# Altium project BELL.PrjPcb
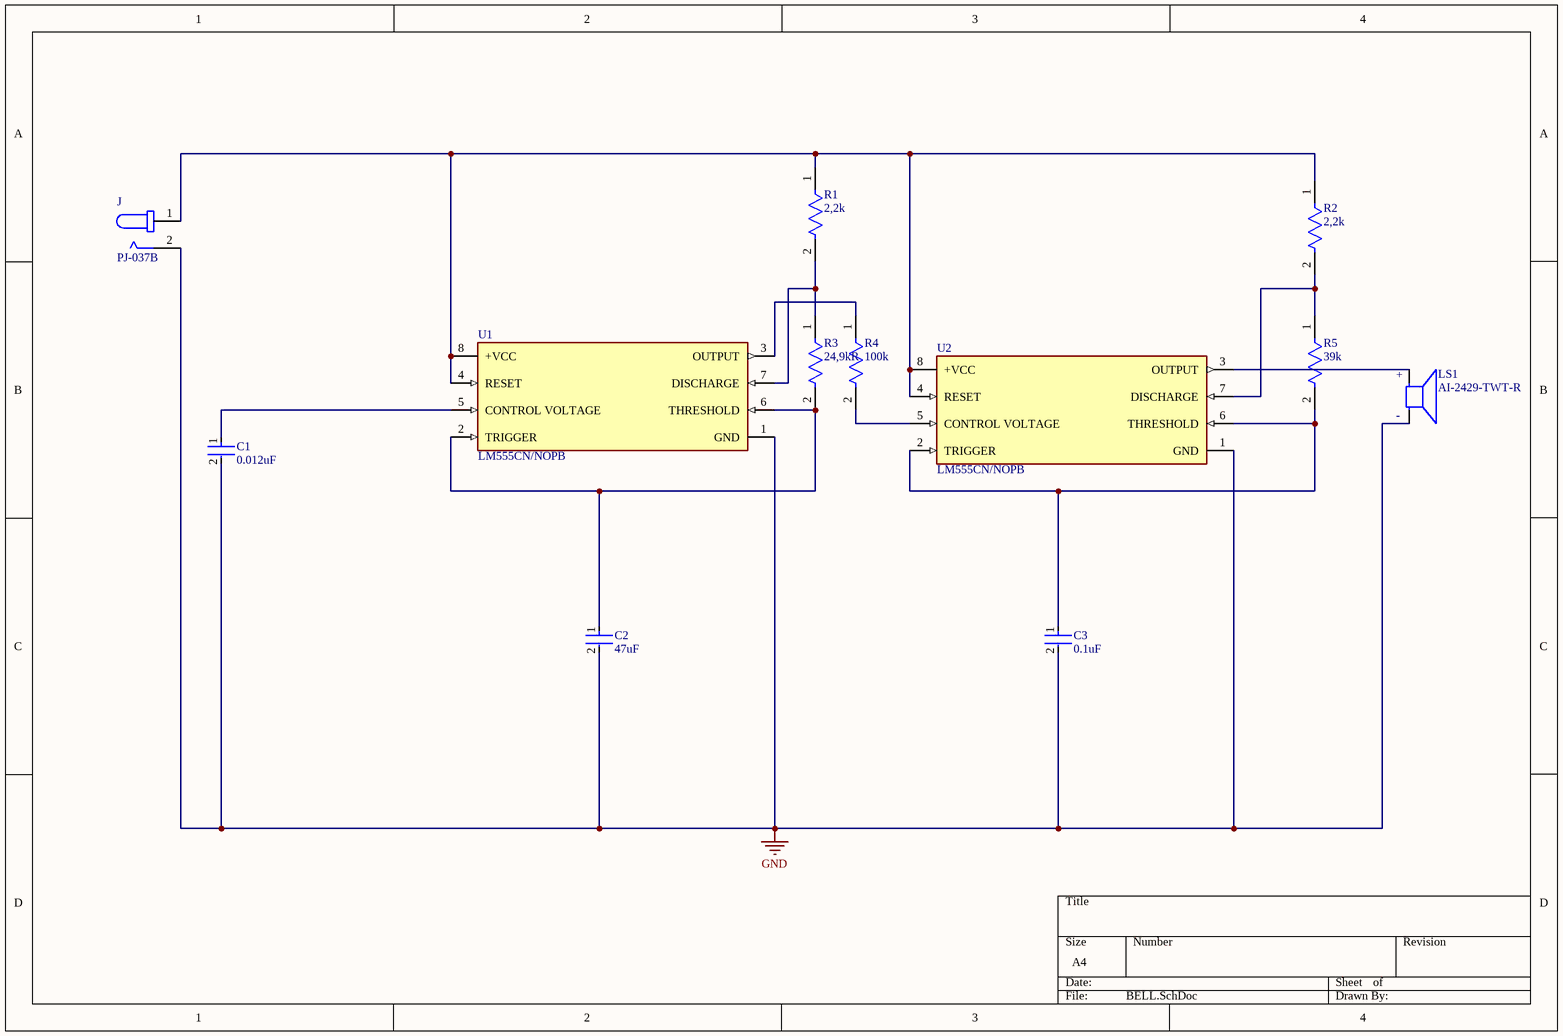
[diagram p0: BELL.SchDoc]
1 sheet, 12 parts. Net scope: global (net labels, ports and power ports of the same name join across sheets).
Board file: BELL.PcbDoc

## Sheet BELL.SchDoc
size A4

### Parts
C1  0.012uF  [FP-GRM033-0_03-IPC_B]
C2  47uF  [FP-MK325M-IPC_B]
C3  0.1uF  [FP-CL46-IPC_B]
J  PJ-037B  [CUI_PJ-037B]
LS1  AI-2429-TWT-R  [XDCR_AI-2429-TWT-R]
R1  2,2k  [FP-RMCF0805-IPC_B]
R2  2,2k  [FP-RMCF0805-IPC_B]
R3  24,9kR  [FP-RT0805-IPC_B]
R4  100k  [FP-CRCW0805-e3-IPC_B]
R5  39k  [FP-KTR10-IPC_B]
U1  LM555CN/NOPB  [FP-P0008A-MFG]
U2  LM555CN/NOPB  [FP-P0008A-MFG]

### Nets
GND: C1.2 C2.2 C3.2 J.2 LS1.N U1.1(GND) U2.1(GND)
NetC1_1: C1.1 U1.5(CONTROL_VOLTAGE)
NetC2_1: C2.1 R3.2 U1.2(TRIGGER) U1.6(THRESHOLD)
NetC3_1: C3.1 R5.2 U2.2(TRIGGER) U2.6(THRESHOLD)
NetJ_1: J.1 R1.1 R2.1 U1.4(RESET) U1.8(+VCC) U2.4(RESET) U2.8(+VCC)
NetLS1_P: LS1.P U2.3(OUTPUT)
NetR1_2: R1.2 R3.1 U1.7(DISCHARGE)
NetR2_2: R2.2 R5.1 U2.7(DISCHARGE)
NetR4_1: R4.1 U1.3(OUTPUT)
NetR4_2: R4.2 U2.5(CONTROL_VOLTAGE)

### Notes on the sheet
- (in symbol AI-2429-TWT-R) +; -

### Library data of the parts
C1 = CMP-2010-01245-2: Cap Ceramic 0.012uF 6.3V X6S 10% SMD 0201 105°C Paper T/R; Manufacturer: Murata; Manufacturer Part Number: GRM033C80J123KE01D; Capacitance: 12nF; Height: 0.3mm; Min Operating Temperature: -55°C; Max Operating Temperature: 105°C; Voltage Rating: 6.3V; Packaging: Tape and Reel; Termination: SMD/SMT; Voltage Rating (DC): 6.3V; Package Quantity: 15000; Radiation Hardening: No; Case/Package: 0201; Dielectric: X6S; Depth: 0.3mm; Case Code (Imperial): 0201; Mount: Surface Mount; Case Code (Metric): 0603; Length: 0.6mm; Tolerance: 10%; Width: 0.3mm; Thickness: 0.013inch; Supplier 1: Digi-Key; Supplier Part Number 1: 490-11351-6-ND; Category: Ceramic Capacitors; RoHS: Yes; Pricing 1: 1=0,10000, 10=0,05400, 50=0,02960, 100=0,02420, 500=0,01730, 1000=0,01360, 2500=0,01236, 5000=0,01137 (USD); Series: GRM; Construction: Flat; RoHS Compliant: Yes; ComponentLink1URL: https://datasheet.ciiva.com/5420/product-5420433.pdf?src-supplier=Mouser; ComponentLink1Description: https://datasheet.ciiva.com/5420/product-5420433.pdf?src-supplier=Mouser; ComponentLink2URL: https://datasheet.ciiva.com/163/partnumbering-e-01-163252.pdf?src-supplier=Digi-Key; ComponentLink2Description: https://datasheet.ciiva.com/163/partnumbering-e-01-163252.pdf?src-supplier=Digi-Key; Price: $0.10
C2 = CMP-2000-06559-2: 1210 47 uF 10 V ±20% Tolerance X7R Multilayer Ceramic Capacitor; Manufacturer: Taiyo Yuden; Manufacturer Part Number: LMK325B7476MM-TR; Voltage Rating: 10V; Packaging: Tape and Reel; Length: 3.2mm; Tolerance: 20%; Height: 2.5mm; Case Code (Metric): 3225; Min Operating Temperature: -55°C; Package Quantity: 500; Halogen Free: Halogen Free; Resistor Type: Ceramic; Capacitance: 47uF; Termination: SMD/SMT; Number of Pins: 2; Lead Free: Lead Free; Voltage Rating (DC): 10V; Width: 2.5mm; Case/Package: 1210; Dielectric: X7R; Mount: Surface Mount; Max Operating Temperature: 125°C; Construction: Flat; Case Code (Imperial): 1210; RoHS Compliant: Yes; Depth: 2.5mm; Thickness: 0.106inch; Voltage: 10V; Series: M; Radiation Hardening: No; Supplier 1: Digi-Key; Supplier Part Number 1: 587-2783-1-ND; Category: Ceramic Capacitors; RoHS: Yes; Stock 1: 85; Pricing 1: 1=1,11000, 10=0,84200, 50=0,69960, 100=0,60240 (USD); REACH SVHC: Unknown; ComponentLink1URL: https://datasheet.ciiva.com/26919/getdatasheetpartid-639547-26919239.pdf?src-supplier=Verical; ComponentLink1Description: https://datasheet.ciiva.com/26919/getdatasheetpartid-639547-26919239.pdf?src-supplier=Verical; ComponentLink2URL: https://datasheet.ciiva.com/2989/lmk325b7476mm-tr-ss-2989850.pdf?src-supplier=Avnet; ComponentLink2Description: https://datasheet.ciiva.com/2989/lmk325b7476mm-tr-ss-2989850.pdf?src-supplier=Avnet; ComponentLink3URL: https://datasheet.ciiva.com/142/lmk325b7476mm-tr-ss-142765.pdf?src-supplier=Digi-Key; ComponentLink3Description: https://datasheet.ciiva.com/142/lmk325b7476mm-tr-ss-142765.pdf?src-supplier=Digi-Key; ComponentLink4URL: https://datasheet.ciiva.com/28645/746258-28645230.pdf?src-supplier=Element14; ComponentLink4Description: https://datasheet.ciiva.com/28645/746258-28645230.pdf?src-supplier=Element14; Price: $1.11
C3 = CMP-13271-002143-1: Ceramic capacitor SMD-0402 100nF /10V X5R# K +-10%, Samsung, RoHS; Manufacturer Part Number: CL05A104KP5NNNC; Dielectric: X5R; Voltage Rating: 10V; Tolerance: 10%; Depth: 0.5mm; Height: 0.5mm; Case/Package: 0402; Case Code (Imperial): 0402; Contact Plating: Tin; Packaging: Tape and Reel; Case Code (Metric): 1005; Capacitance: 100nF; Mount: Surface Mount; Max Operating Temperature: 85°C; Radiation Hardening: No; Length: 1mm; Min Operating Temperature: -55°C; Width: 0.02inch; Thickness: 0.022inch; Supplier 1: Digi-Key; Supplier Part Number 1: 1276-1022-1-ND; Category: Ceramic Capacitors; Manufacturer: Samsung; RoHS: Yes; Stock 1: 797961; Pricing 1: 1=0,10000, 10=0,01700, 50=0,00900, 100=0,00740, 500=0,00528, 1000=0,00414, 2500=0,00377, 5000=0,00346 (USD); Series: CL; Construction: Flat; RoHS Compliant: Yes; ComponentLink1URL: https://datasheet.ciiva.com/25709/cl05a104kp5nnnc-25709120.pdf?src-supplier=Digi-Key; ComponentLink1Description: https://datasheet.ciiva.com/25709/cl05a104kp5nnnc-25709120.pdf?src-supplier=Digi-Key; ComponentLink2URL: https://datasheet.ciiva.com/26838/getdatasheetpartid-358611-26838151.pdf?src-supplier=Verical; ComponentLink2Description: https://datasheet.ciiva.com/26838/getdatasheetpartid-358611-26838151.pdf?src-supplier=Verical; ComponentLink3URL: https://datasheet.ciiva.com/16437/cl05b104kq5nnnc-16437370.pdf?src-supplier=Future+Electronics; ComponentLink3Description: https://datasheet.ciiva.com/16437/cl05b104kq5nnnc-16437370.pdf?src-supplier=Future+Electronics; ComponentLink4URL: https://datasheet.ciiva.com/26309/mlcc-catalogdownload2013-eng-26309007.pdf?src-supplier=Distrelec; ComponentLink4Description: https://datasheet.ciiva.com/26309/mlcc-catalogdownload2013-eng-26309007.pdf?src-supplier=Distrelec; Price: $0.10
J = PJ-037B: 2.5 x 6.5 mm, 2.5 A, Horizontal, Through Hole, Dc Power Jack Connector; Manufacturer: CUI; MF: CUI Devices; Gender: Male; Shielding: Unshielded; Current Rating: 2.5A; Voltage Rating: 24V; Insulation Resistance: 100MR; Number of Conductors: 2; Price: $0.71; Package: None; MP: PJ-037B; Value: *; Availability: Unavailable; SnapEDA_Link: https://www.snapeda.com/parts/PJ-037B/CUI%20Devices/view-part/493700/?ref=snap; CUI_purchase_URL: https://www.cuidevices.com/product/interconnect/connectors/dc-power-connectors/jacks/pj-037b?utm_source=snapeda.com&utm_medium=referral&utm_campaign=snapedaBOM; Supplier 1: Digi-Key; Supplier Part Number 1: CP-037BH-ND; Supplier 2: Digi-Key; Supplier Part Number 2: CP-037B-ND; Manufacturer Part Number: PJ-037B; RoHS: Yes; Category: Connectors; Mount: Through Hole; Color: Black; Contact Plating: Nickel; Contact Material: Copper; Housing Material: Thermoplastic; Housing Color: Black; Min Operating Temperature: -25°C; Max Operating Temperature: 85°C; Termination: Solder; Connector Type: Jack; Package Quantity: 500; Contact Gender: Male; Orientation: Horizontal; Packaging: Bulk; Series: -; Lead Free: Lead Free; Flammability Rating: UL94 V-0; RoHS Compliant: Yes; ComponentLink1URL: http://www.mouser.com/ds/2/670/pj-037b-515963.pdf?src-supplier=Mouser; ComponentLink1Description: http://www.mouser.com/ds/2/670/pj-037b-515963.pdf?src-supplier=Mouser; ComponentLink2URL: https://www.cui.com/product/resource/digikeypdf/pj-037b.pdf?src-supplier=Digi-Key; ComponentLink2Description: https://www.cui.com/product/resource/digikeypdf/pj-037b.pdf?src-supplier=Digi-Key; Case/Package: Bag
LS1 = AI-2429-TWT-R: Audio Indicator Piezo 12VDC 10mA Pin 3VDC 2400Hz to 3400Hz Through Hole; Manufacturer: Projects Unlimited; MF: PUI Audio; Operating Supply Current: 8mA; Frequency: 2.9kHz; Max Supply Voltage (DC): 20V; Min Supply Voltage (DC): 3V; Voltage Rating (DC): 12V; Bandwidth: 2.8kHz; Outside Diameter: 23.8mm; Washable: Yes; MP: AI-2429-TWT-R; SnapEDA_Link: https://www.snapeda.com/parts/AI-2429-TWT-R/PUI%20Audio/view-part/439756/?ref=snap; Availability: In Stock; Check_prices: https://www.snapeda.com/parts/AI-2429-TWT-R/PUI%20Audio/view-part/439756/?ref=eda; Value: *; Purchase-URL: https://pricing.snapeda.com/search/part/AI-2429-TWT-R/?ref=eda; Package: PUI Audio; Price: $3.28; Supplier 1: Digi-Key; Supplier Part Number 1: 668-1028-ND; Category: Audio Products; Manufacturer Part Number: AI-2429-TWT-R; RoHS: Yes; Stock 1: 7681; Pricing 1: 1=3,28000, 10=3,15600, 25=3,02880, 50=2,84440, 100=2,66720, 450=2,35409 (USD); Mount: Through Hole; Contact Plating: Tin; Color: Black; Min Operating Temperature: -20°C; Max Operating Temperature: 70°C; Termination: PC Pins; Max Supply Current: 10mA; Packaging: Tray; Package Quantity: 50; Current Rating: 8mA; Min Supply Voltage: 3V; Max Supply Voltage: 20V; Self Resonant Frequency: 2.9kHz; Nominal Supply Voltage (DC): 12V; Diameter: 23.8mm; Length: 23.8mm; Width: 23.8mm; Height: 16mm; REACH SVHC: No SVHC; Lead Free: Lead Free; ComponentLink1URL: https://datasheet.ciiva.com/1324/ai-2429-twt-r-1324339.pdf?src-supplier=Element14; ComponentLink1Description: https://datasheet.ciiva.com/1324/ai-2429-twt-r-1324339.pdf?src-supplier=Element14; ComponentLink2URL: https://datasheet.ciiva.com/4623/ai-2429-twt-r-62789-4623298.pdf?src-supplier=Mouser; ComponentLink2Description: https://datasheet.ciiva.com/4623/ai-2429-twt-r-62789-4623298.pdf?src-supplier=Mouser; ComponentLink3URL: https://datasheet.ciiva.com/1304/ai-2429-twt-r-1304709.pdf?src-supplier=Farnell; ComponentLink3Description: https://datasheet.ciiva.com/1304/ai-2429-twt-r-1304709.pdf?src-supplier=Farnell; ComponentLink4URL: https://datasheet.ciiva.com/0/ai-2429-twt-r-356.pdf?src-supplier=Digi-Key; ComponentLink4Description: https://datasheet.ciiva.com/0/ai-2429-twt-r-356.pdf?src-supplier=Digi-Key
R1 R2 = CMP-26527-000414-1: Res Thick Film 0805 2.2K Ohm 1% 0.125W ±100ppm/°C Molded SMD Paper T/R; Manufacturer: Stackpole Electronics; Manufacturer Part Number: RMCF0805FT2K20; Max Power Dissipation: 125mW; Resistance: 2.2kR; Number of Terminations: 2; Packaging: Tape and Reel; Features: Automotive AEC-Q200; Contact Plating: Tin; Max Operating Temperature: 155°C; Case/Package: 0805; Temperature Coefficient: 100ppm/°C; Mount: Surface Mount; Tolerance: 1%; Length: 0.079inch; Resistor Type: Thick Film; Series: RMCF; Package Quantity: 10000; RoHS Compliant: Yes; Radiation Hardening: No; Width: 0.049inch; Height: 0.026inch; Min Operating Temperature: -55°C; Supplier 1: Digi-Key; Supplier Part Number 1: RMCF0805FT2K20CT-ND; Category: Chip Resistor - Surface Mount; RoHS: Yes; Stock 1: 486113; Pricing 1: 1=0,10000, 10=0,02700, 100=0,01090, 1000=0,00488, 2500=0,00423 (USD); Case Code (Metric): 2012; Case Code (Imperial): 0805; Construction: Rectangular; Depth: 1.25mm; Military Standard: Not; ComponentLink1URL: https://www.verical.com/server-webapp/html/getDatasheet?partID=461124&src-supplier=Verical; ComponentLink1Description: https://www.verical.com/server-webapp/html/getDatasheet?partID=461124&src-supplier=Verical; ComponentLink2URL: http://components.arrow.com/part/dataview/44988194S7167689N1174?src-supplier=Arrow+Electronics; ComponentLink2Description: http://components.arrow.com/part/dataview/44988194S7167689N1174?src-supplier=Arrow+Electronics; ComponentLink3URL: https://www.seielect.com/catalog/SEI-Packaging.pdf?src-supplier=Digi-Key; ComponentLink3Description: https://www.seielect.com/catalog/SEI-Packaging.pdf?src-supplier=Digi-Key; ComponentLink4URL: https://www.seielect.com/catalog/SEI-RMCF_RMCP.pdf?src-supplier=Avnet; ComponentLink4Description: https://www.seielect.com/catalog/SEI-RMCF_RMCP.pdf?src-supplier=Avnet; Price: $0.10
R3 = CMP-03412-011084-1: Res Thin Film 0805 24.9K Ohm 0.1% 1/8W ±25ppm/°C Molded SMD SMD Paper T/R; Manufacturer: Yageo; Manufacturer Part Number: RT0805BRD0724K9L; Power Rating: 0.125W; Voltage Rating: 150V; Resistance: 24.9KΩ; Tolerance: 0.0025; Value: 24.9KΩ; Max Power Dissipation: 125mW; Category: Chip Resistor - Surface Mount; Composition: Thin Film; Temperature Range High: +155°C; Temperature Coefficient: 25 ppm/°C; ComponentLink2URL: http://www.yageo.com/documents/recent/PYu-RT_1-to-0.01_RoHS_L_9.pdf; Series: RT; ComponentLink2Description: Datasheet; Automotive: No; Device Class L2: Resistors; Mouser Description: Res Thin Film 0805 24.9K Ohm 0.1% 1/8W ±25ppm/°C Molded SMD SMD Paper T/R; Temperature: -55°C to +155°C; Digikey Description: RES SMD 24.9K OHM 0.1% 1/8W 0805; RoHS: TRUE; Package: RT0805; Device Class L1: Passive Components; Height: 0.6mm; Octopart: https://octopart.com/rt0805brd0724k9l-yageo-1279812; Device Class L3: Chip SMD Resistors; Temperature Range Low: -55°C; Footprint Url: http://www.yageo.com/exep/pages/download/literatures/PYu-R_Mount_10.pdf; Lead Free: Yes; Ipc Land Pattern Name: RESC200125X50; Supplier Part Number 1: YAG1842CT-ND; Supplier 1: Digi-Key; Stock 1: 1611; Pricing 1: 1=0,38000, 10=0,27200, 100=0,10870, 1000=0,05357, 2500=0,04963 (USD); Case/Package: 0805; Case Code (Metric): 2012; Case Code (Imperial): 0805; Contact Plating: Tin,Matte; Min Operating Temperature: -55°C; Max Operating Temperature: 125°C; Packaging: Tape and Reel; Package Quantity: 5000; Termination: SMD/SMT; Resistor Type: Thin Film; Number of Terminations: 2; Voltage Rating (DC): 150V; Features: Moisture Resistant; Construction: Rectangular; Length: 0.079inch; Width: 0.049inch; Depth: 1.25mm; Radiation Hardening: No; Military Standard: Not; RoHS Compliant: Yes; ComponentLink1URL: https://datasheet.ciiva.com/8890/pyu-rt-1-to-0-05-rohs-l-4-8890022.pdf?src-supplier=Avnet; ComponentLink1Description: https://datasheet.ciiva.com/8890/pyu-rt-1-to-0-05-rohs-l-4-8890022.pdf?src-supplier=Avnet; ComponentLink3URL: https://datasheet.ciiva.com/2584/pyu-rt-1-to-0-05-rohs-l-4-2584873.pdf?src-supplier=Digi-Key; ComponentLink3Description: https://datasheet.ciiva.com/2584/pyu-rt-1-to-0-05-rohs-l-4-2584873.pdf?src-supplier=Digi-Key; ComponentLink4URL: https://datasheet.ciiva.com/46634/pyu-rt-1-to-0-05-rohs-l-5-46634875.pdf?src-supplier=Digi-Key; ComponentLink4Description: https://datasheet.ciiva.com/46634/pyu-rt-1-to-0-05-rohs-l-5-46634875.pdf?src-supplier=Digi-Key; Price: $0.38
R4 = CMP-2001-04187-2: Res Thick Film 0805 100K Ohm 1% 0.125W ±100ppm/°C Molded SMD Paper T/R; Manufacturer: Stackpole Electronics; Manufacturer Part Number: RMCF0805FT100K; Voltage Rating: 150V; Resistance: 100kR; Power Rating: 125mW; Number of Pins: 2; Radiation Hardening: No; Tolerance: 1%; Military Standard: Not; Height: 0.02inch; Case Code (Metric): 2012; Width: 0.049inch; Features: Automotive AEC-Q200; Package Quantity: 10000; Voltage Rating (DC): 150V; Case Code (Imperial): 0805; Depth: 1.25mm; Lead Free: Lead Free; Packaging: Tape and Reel; Length: 2mm; Number of Terminations: 2; Max Power Dissipation: 125mW; Temperature Coefficient: 100ppm/°C; Weight: 0.000194oz; Composition: Thick Film; Contact Plating: Tin; Min Operating Temperature: -55°C; Max Operating Temperature: 155°C; Case/Package: 0805; Supplier 1: Digi-Key; Supplier Part Number 1: RMCF0805FT100KCT-ND; Category: Chip Resistor - Surface Mount; RoHS: Yes; Stock 1: 1744155; Pricing 1: 1=0,10000, 10=0,02700, 100=0,01090, 1000=0,00488, 2500=0,00423 (USD); Mount: Surface Mount; Resistor Type: Thick Film; Working Voltage: 150V; Series: RMCF; Construction: Rectangular; Technology: THICK FILM; RoHS Compliant: Yes; ComponentLink1URL: http://components.arrow.com/part/dataview/50568053S7005095N1174?src-supplier=Arrow+Electronics; ComponentLink1Description: http://components.arrow.com/part/dataview/50568053S7005095N1174?src-supplier=Arrow+Electronics; ComponentLink2URL: https://www.verical.com/server-webapp/html/getDatasheet?partID=360692&src-supplier=Verical; ComponentLink2Description: https://www.verical.com/server-webapp/html/getDatasheet?partID=360692&src-supplier=Verical; ComponentLink3URL: http://www.onlinecomponents.com/productFiles/mf-SEI/sei-rmcp.pdf?src-supplier=Onlinecomponents.com; ComponentLink3Description: http://www.onlinecomponents.com/productFiles/mf-SEI/sei-rmcp.pdf?src-supplier=Onlinecomponents.com; ComponentLink4URL: http://www.seielect.com/catalog/sei-rmc.pdf?src-supplier=Future+Electronics; ComponentLink4Description: http://www.seielect.com/catalog/sei-rmc.pdf?src-supplier=Future+Electronics; ComponentLink5URL: https://www.seielect.com/catalog/SEI-Packaging.pdf?src-supplier=Digi-Key; ComponentLink5Description: https://www.seielect.com/catalog/SEI-Packaging.pdf?src-supplier=Digi-Key; ComponentLink6URL: https://www.seielect.com/catalog/SEI-RMCF_RMCP.pdf?src-supplier=Avnet; ComponentLink6Description: https://www.seielect.com/catalog/SEI-RMCF_RMCP.pdf?src-supplier=Avnet; Price: $0.10
R5 = CMP-08839-006009-1: Res High Voltage 0805 39K Ohm 1/8W 1% SMD; Manufacturer: Rohm; Manufacturer Part Number: KTR10EZPF3902; Temperature Coefficient: 100ppm/°C; Max Power Dissipation: 125mW; Resistance: 39kR; Min Operating Temperature: -55°C; Number of Terminations: 2; Features: Automotive AEC-Q200; Tolerance: 1%; Case Code (Metric): 2012; Case/Package: 0805; Series: KTR; Package Quantity: 5000; Height: 0.026inch; Packaging: Tape and Reel; Resistor Type: Thick Film; Length: 0.079inch; RoHS Compliant: Yes; Max Operating Temperature: 155°C; Case Code (Imperial): 0805; Width: 0.049inch; Supplier Part Number 1: RHM39KAHCT-ND; Supplier 1: Digi-Key; Category: Chip Resistor - Surface Mount; RoHS: Yes; Stock 1: 983; Pricing 1: 1=0,18000, 10=0,15200, 100=0,05930, 1000=0,02484, 2500=0,02277 (USD); ComponentLink1URL: https://datasheet.ciiva.com/14929/ktr-14929997.pdf?src-supplier=Digi-Key; ComponentLink1Description: https://datasheet.ciiva.com/14929/ktr-14929997.pdf?src-supplier=Digi-Key; Price: $0.18
U1 U2 = CMP-0056-00016-4: Timer; 8-PIN Mdip; 8 Pins; +18 V (max.); 3 ma (typ.) @ 5 V, +25 C Supply; Manufacturer: Texas Instruments; Min Supply Voltage: 4.5V; Standoff Height: 0.51mm; Number Of Timers/Counters: 1; Max Supply Voltage: 16V; Max Junction Temp: +70°C; Nominal Supply Current: 3mA; Frequency: 10MHz; Max Power Dissipation: 1.18W; High Level Output Current: -200mA; Low Level Output Current: 200mA; Current Rating: 200A; ComponentLink2Description: Datasheet; Category: IC; Manufacturer Part Number: LM555CN/NOPB; Digikey Description: IC OSC SINGLE TIMER 100KHZ 8-DIP; Ambient Temperature Range High: +70°C; Automotive: No; Device Class L3: Timers and Oscillators; Device Class L1: Integrated Circuits (ICs); Temperature Range High: +70°C; Lead Free: Yes; ComponentLink2URL: http://www.ti.com/lit/ds/symlink/lm555.pdf; Octopart: https://octopart.com/lm555cn%2Fnopb-texas+instruments-24814897; RoHS: TRUE; Ambient Temperature Range Low: 0°C; Temperature Range Low: 0°C; Package: P0008A; Temperature: 0°C to +70°C; Height: 5.08mm; Device Class L2: Clock and Timing; Supplier 1: Digi-Key; Supplier Part Number 1: LM555CNNS/NOPB-ND; Pricing 1: 1=1,38000, 10=1,23200, 25=1,16920, 100=0,96060, 250=0,89792, 500=0,79352, 1000=0,68950 (USD); Mount: Through Hole; Case/Package: PDIP; Number of Pins: 8; Weight: 0.01lb; Contact Plating: Tin,Matte; Min Operating Temperature: 0°C; Max Operating Temperature: 70°C; Packaging: Rail/Tube; Number of Channels: 1; Package Quantity: 40; Power Dissipation: 1.18W; Quiescent Current: 3mA; Output Current: 200mA; Series: LM555; Supply Current: 3mA; Length: 9.27mm; Width: 6.35mm; Radiation Hardening: No; REACH SVHC: No SVHC; RoHS Compliant: Yes; ComponentLink1URL: https://datasheet.ciiva.com/14094/djnat-timer-lm-555c-en-14094964.pdf?src-supplier=Distrelec; ComponentLink1Description: https://datasheet.ciiva.com/14094/djnat-timer-lm-555c-en-14094964.pdf?src-supplier=Distrelec; ComponentLink3URL: https://datasheet.ciiva.com/26795/lm555cn-nopb-26795380.pdf?src-supplier=IIIC; ComponentLink3Description: https://datasheet.ciiva.com/26795/lm555cn-nopb-26795380.pdf?src-supplier=IIIC; ComponentLink4URL: https://datasheet.ciiva.com/1139/1902863-1139387.pdf?src-supplier=Element14; ComponentLink4Description: https://datasheet.ciiva.com/1139/1902863-1139387.pdf?src-supplier=Element14; ComponentLink5URL: https://datasheet.ciiva.com/6668/lm555-6668283.pdf?src-supplier=Digi-Key; ComponentLink5Description: https://datasheet.ciiva.com/6668/lm555-6668283.pdf?src-supplier=Digi-Key; ComponentLink6URL: https://datasheet.ciiva.com/15152/getdatasheetpartid-644274-15152732.pdf?src-supplier=Verical; ComponentLink6Description: https://datasheet.ciiva.com/15152/getdatasheetpartid-644274-15152732.pdf?src-supplier=Verical; Price: $1.38